# EAGLE schematic LDO (EAGLE 9.6.2)
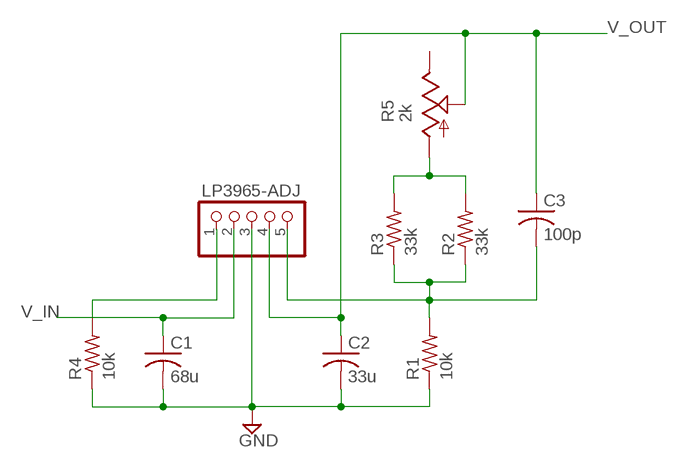
[diagram p0: schematic, sheet 1]

## Parts
C1  68u  C-USC0805  [C0805]
C2  33u  C-USC0805  [C0805]
C3  100p  C-USC0805  [C0805]
LP3965-ADJ  PINHD-1X5  [1X05]
R1  10k  R-US_R0805  [R0805]
R2  33k  R-US_R0805  [R0805]
R3  33k  R-US_R0805  [R0805]
R4  10k  R-US_R0805  [R0805]
R5  2k  TRIM_US-3223G  [3223G]

## Nets
GND: C1.2 C2.2 LP3965-ADJ.3 R1.1 R4.1
N$2: R2.2 R3.2 R5.1(A)
N$3: C3.2 LP3965-ADJ.5 R1.2 R2.1 R3.1
N$8: LP3965-ADJ.1 R4.2
V_IN: C1.1 LP3965-ADJ.2
V_OUT: C2.1 C3.1 LP3965-ADJ.4 R5.2(S)
Unconnected: R5.3(E)

## Library data of the parts
C1-C3 = rcl:C-US: CAPACITOR, American symbol; SPICEPREFIX: C
LP3965-ADJ = pinhead:PINHD-1X5: PIN HEADER
R1-R4 = rcl:R-US_: RESISTOR, American symbol; SPICEPREFIX: R
R5 = pot:TRIM_US-: POTENTIOMETER